# Altium schematic sheet 1_Measurement_and_MPPT.SchDoc: Measurement and MPPT
size A3; DrawnBy: Sara V. Martínez; Engineer: Flight; DocumentNumber: 4; Revision: V0.1; SheetNumber: 4; SheetTotal: 11
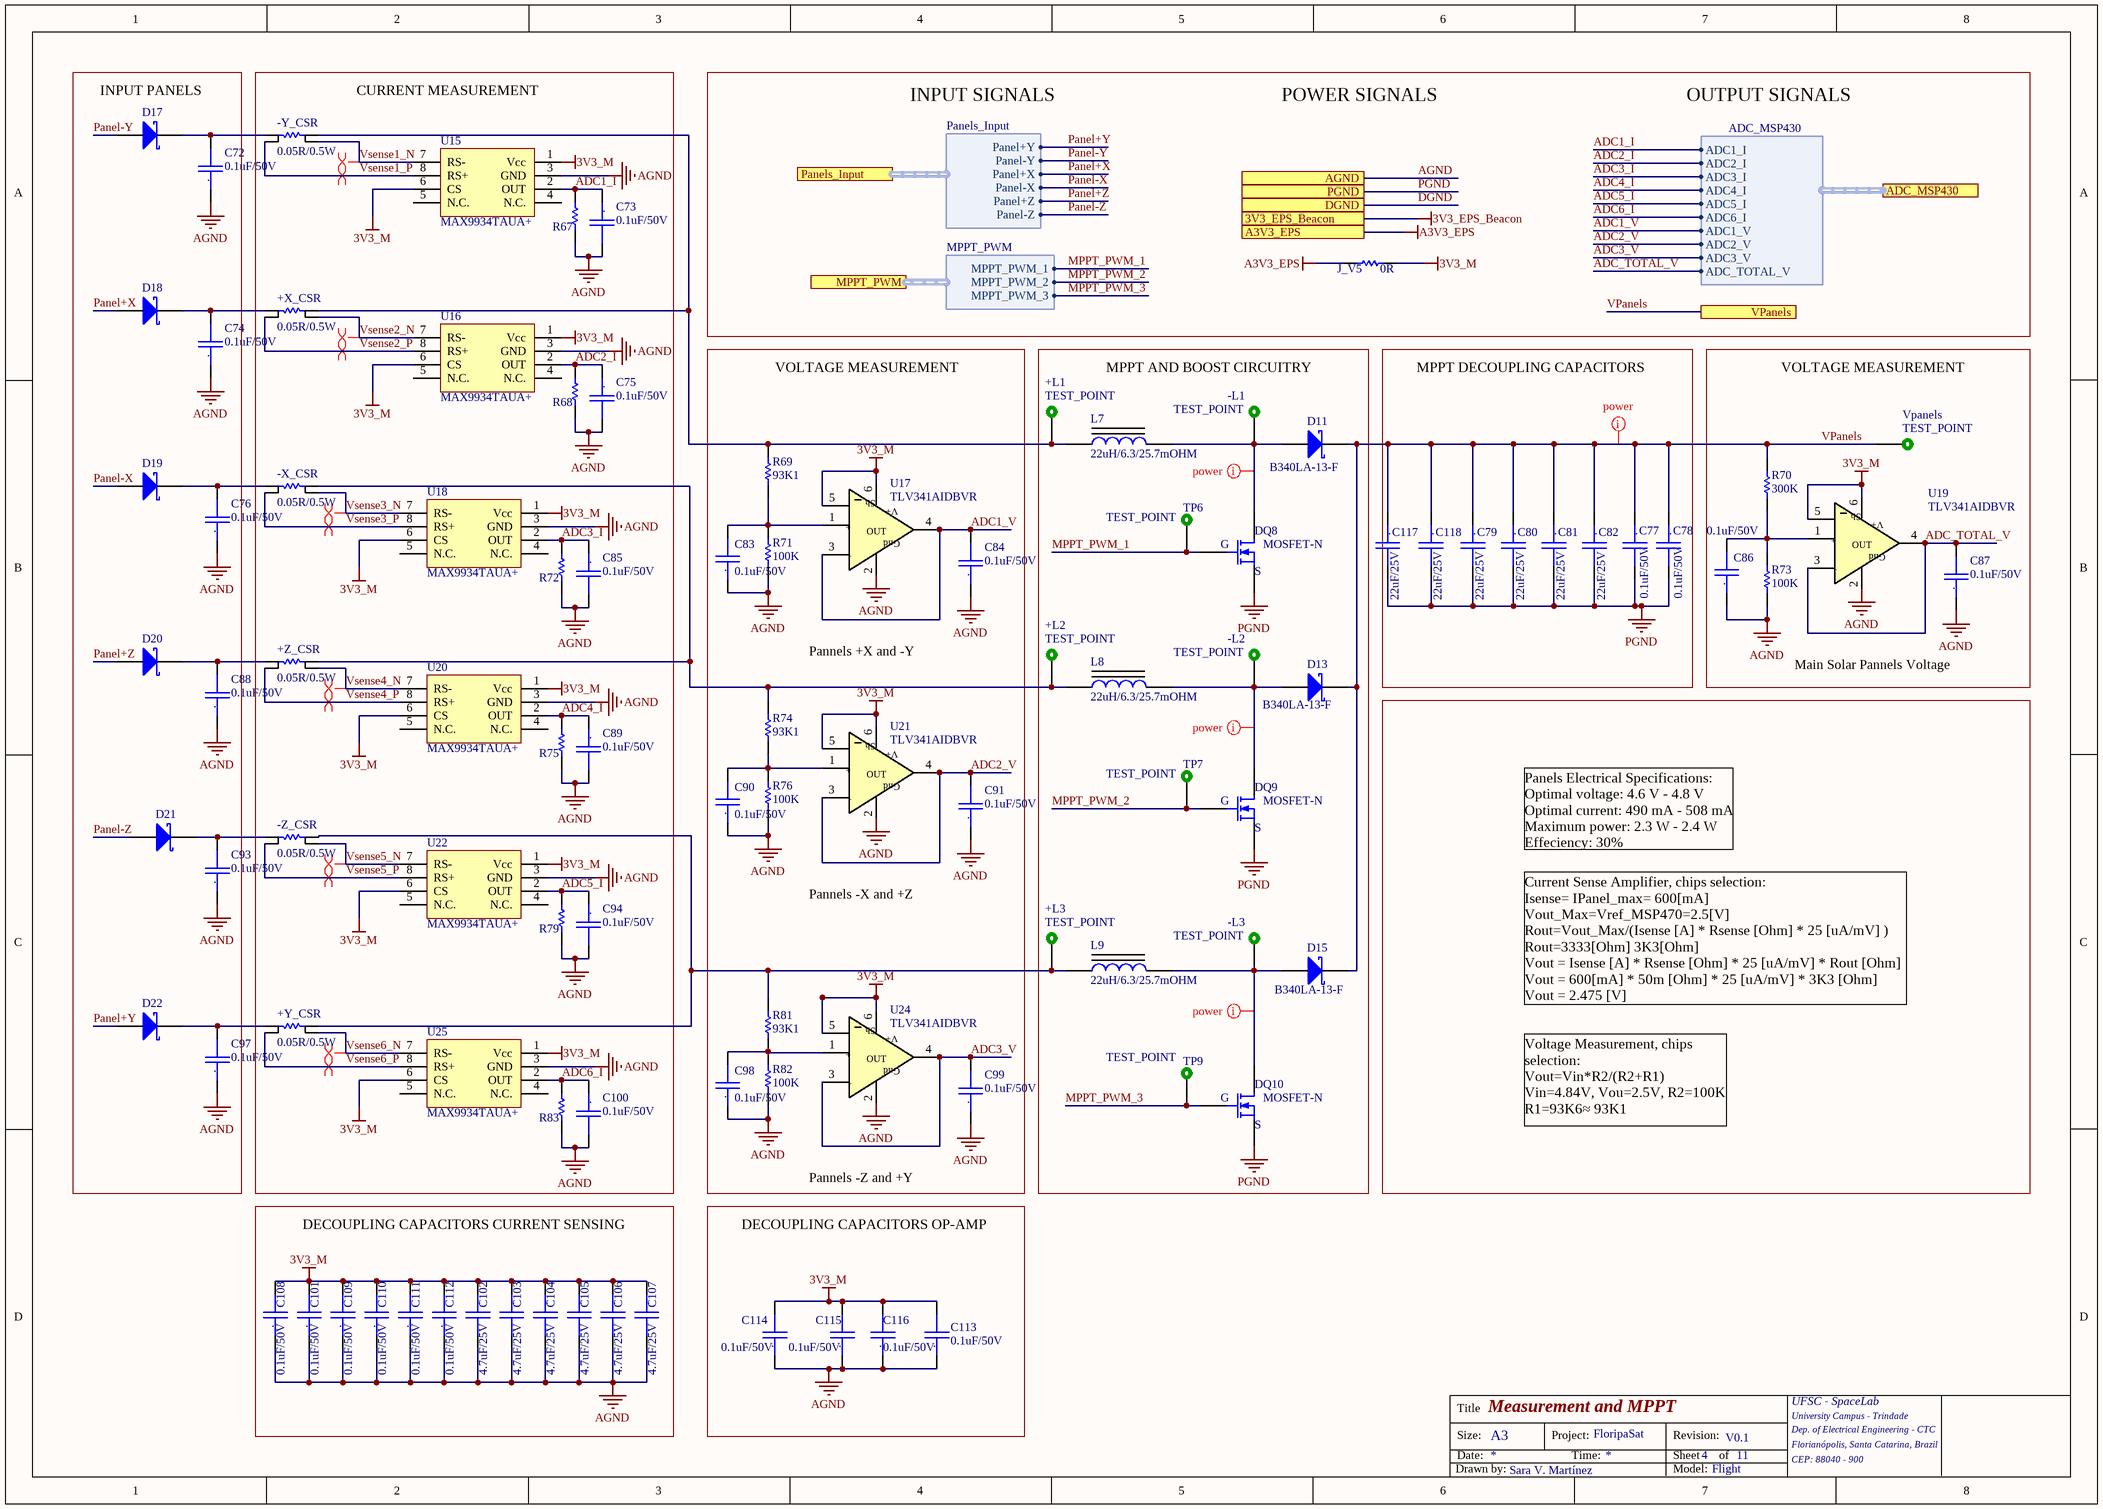
[diagram p0: 1_Measurement_and_MPPT.SchDoc]

## Parts
+L1  TEST_POINT  [TEST_POINT]  (no BOM)
+L2  TEST_POINT  [TEST_POINT]  (no BOM)
+L3  TEST_POINT  [TEST_POINT]  (no BOM)
+X_CSR  0.05R/0.5W  [1206 - ohmite]
+Y_CSR  0.05R/0.5W  [1206 - ohmite]
+Z_CSR  0.05R/0.5W  [1206 - ohmite]
-L1  TEST_POINT  [TEST_POINT]  (no BOM)
-L2  TEST_POINT  [TEST_POINT]  (no BOM)
-L3  TEST_POINT  [TEST_POINT]  (no BOM)
-X_CSR  0.05R/0.5W  [1206 - ohmite]
-Y_CSR  0.05R/0.5W  [1206 - ohmite]
-Z_CSR  0.05R/0.5W  [1206 - ohmite]
C72  0.1uF/50V  [CC0603]
C73  0.1uF/50V  [CC0603]
C74  0.1uF/50V  [CC0603]
C75  0.1uF/50V  [CC0603]
C76  0.1uF/50V  [CC0603]
C77  0.1uF/50V  [CC0805]
C78  0.1uF/50V  [CC0805]
C79  22uF/25V  [CC1210]
C80  22uF/25V  [CC1210]
C81  22uF/25V  [CC1210]
C82  22uF/25V  [CC1210]
C83  0.1uF/50V  [CC0603]
C84  0.1uF/50V  [CC0603]
C85  0.1uF/50V  [CC0603]
C86  0.1uF/50V  [CC0603]
C87  0.1uF/50V  [CC0603]
C88  0.1uF/50V  [CC0603]
C89  0.1uF/50V  [CC0603]
C90  0.1uF/50V  [CC0603]
C91  0.1uF/50V  [CC0603]
C93  0.1uF/50V  [CC0603]
C94  0.1uF/50V  [CC0603]
C97  0.1uF/50V  [CC0603]
C98  0.1uF/50V  [CC0603]
C99  0.1uF/50V  [CC0603]
C100  0.1uF/50V  [CC0603]
C101  0.1uF/50V  [CC0603]
C102  4.7uF/25V  [CC0805]
C103  4.7uF/25V  [CC0805]
C104  4.7uF/25V  [CC0805]
C105  4.7uF/25V  [CC0805]
C106  4.7uF/25V  [CC0805]
C107  4.7uF/25V  [CC0805]
C108  0.1uF/50V  [CC0603]
C109  0.1uF/50V  [CC0603]
C110  0.1uF/50V  [CC0603]
C111  0.1uF/50V  [CC0603]
C112  0.1uF/50V  [CC0603]
C113  0.1uF/50V  [CC0603]
C114  0.1uF/50V  [CC0603]
C115  0.1uF/50V  [CC0603]
C116  0.1uF/50V  [CC0603]
C117  22uF/25V  [CC1210]
C118  22uF/25V  [CC1210]
D11  B340LA-13-F  [DO-214AC]
D13  B340LA-13-F  [DO-214AC]
D15  B340LA-13-F  [DO-214AC]
D17  DNP  [SOD323F]  (value not drawn)
D18  DNP  [SOD323F]  (value not drawn)
D19  DNP  [SOD323F]  (value not drawn)
D20  DNP  [SOD323F]  (value not drawn)
D21  DNP  [SOD323F]  (value not drawn)
D22  DNP  [SOD323F]  (value not drawn)
J_V5  0R  [0805]
L7  22uH/6.3/25.7mOHM  [IND_HC9]
L8  22uH/6.3/25.7mOHM  [IND_HC9]
L9  22uH/6.3/25.7mOHM  [IND_HC9]
Q8  MOSFET-N  [SOIC8_Mosfet]
Q9  MOSFET-N  [SOIC8_Mosfet]
Q10  MOSFET-N  [SOIC8_Mosfet]
R67  3k3  [0805]  (value not drawn)
R68  3k3  [0805]  (value not drawn)
R69  93K1  [0603]
R70  300K  [0603]
R71  100K  [0603]
R72  3k3  [0805]  (value not drawn)
R73  100K  [0603]
R74  93K1  [0603]
R75  3k3  [0805]  (value not drawn)
R76  100K  [0603]
R79  3k3  [0805]  (value not drawn)
R81  93K1  [0603]
R82  100K  [0603]
R83  3k3  [0805]  (value not drawn)
TP6  TEST_POINT  [TEST_POINT]  (no BOM)
TP7  TEST_POINT  [TEST_POINT]  (no BOM)
TP9  TEST_POINT  [TEST_POINT]  (no BOM)
U15  MAX9934TAUA+  [MSOP-8]
U16  MAX9934TAUA+  [MSOP-8]
U17  TLV341AIDBVR  [SOT-23 6L]
U18  MAX9934TAUA+  [MSOP-8]
U19  TLV341AIDBVR  [SOT-23 6L]
U20  MAX9934TAUA+  [MSOP-8]
U21  TLV341AIDBVR  [SOT-23 6L]
U22  MAX9934TAUA+  [MSOP-8]
U24  TLV341AIDBVR  [SOT-23 6L]
U25  MAX9934TAUA+  [MSOP-8]
Vpanels  TEST_POINT  [TEST_POINT]  (no BOM)

## Blocks framed on the sheet
INPUT PANELS: C72 C74 C76 C88 C93 C97 D17-D22
CURRENT MEASUREMENT: +X_CSR +Y_CSR +Z_CSR -X_CSR -Y_CSR -Z_CSR C73 C75 C85 C89 C94 C100 R67 R68 R72 R75 R79 R83 U15 U16 U18 U20 U22 U25
VOLTAGE MEASUREMENT: C83 C84 C90 C91 C98 C99 R69 R71 R74 R76 R81 R82 U17 U21 U24
MPPT AND BOOST CIRCUITRY: +L1-+L3 -L1--L3 D11 D13 D15 L7-L9 Q8-Q10 TP6 TP7 TP9
MPPT DECOUPLING CAPACITORS: C77-C82 C117 C118
VOLTAGE MEASUREMENT: C86 C87 R70 R73 U19 Vpanels
DECOUPLING CAPACITORS CURRENT SENSING: C101-C112
DECOUPLING CAPACITORS OP-AMP: C113-C116

## Ports
3V3_EPS_Beacon, A3V3_EPS, ADC_MSP430 (harness ADC_MSP430), AGND, DGND, MPPT_PWM (harness MPPT_PWM), Panels_Input (harness Panels_Input), PGND, VPanels

## Harnesses
Panels_Input: Panel+Y, Panel-Y, Panel+X, Panel-X, Panel+Z, Panel-Z
ADC_MSP430: ADC1_I, ADC2_I, ADC3_I, ADC1_V, ADC2_V, ADC3_V, ADC_TOTAL_V, ADC4_I, ADC5_I, ADC6_I
MPPT_PWM: MPPT_PWM_1, MPPT_PWM_2, MPPT_PWM_3

## Nets
3V3_EPS_Beacon: port 3V3_EPS_Beacon
3V3_M: C101.2 C102.1 C103.1 C104.1 C105.1 C106.1 C107.1 C108.2 C109.2 C110.2 C111.2 C112.2 C113.2 C114.2 C115.2 C116.2 J_V5.1 U15.1(Vcc) U15.6(CS) U16.1(Vcc) U16.6(CS) U17.5(EN) U17.6(V+) U18.1(Vcc) U18.6(CS) U19.5(EN) U19.6(V+) U20.1(Vcc) U20.6(CS) U21.5(EN) U21.6(V+) U22.1(Vcc) U22.6(CS) U24.5(EN) U24.6(V+) U25.1(Vcc) U25.6(CS)
A3V3_EPS: J_V5.2 ; port A3V3_EPS
AGND: C72.1 C73.2 C74.1 C75.2 C76.1 C83.1 C84.1 C85.2 C86.1 C87.1 C88.1 C89.2 C90.1 C91.1 C93.1 C94.2 C97.1 C98.1 C99.1 C100.2 C101.1 C102.2 C103.2 C104.2 C105.2 C106.2 C107.2 C108.1 C109.1 C110.1 C111.1 C112.1 C113.1 C114.1 C115.1 C116.1 R67.1 R68.1 R71.1 R72.1 R73.1 R75.1 R76.1 R79.1 R82.1 R83.1 U15.3(GND) U16.3(GND) U17.2(Gnd) U18.3(GND) U19.2(Gnd) U20.3(GND) U21.2(Gnd) U22.3(GND) U24.2(Gnd) U25.3(GND) ; port AGND
PGND: C77.2 C78.2 C79.2 C80.2 C81.2 C82.2 C117.2 C118.2 Q8.1(S) Q9.1(S) Q10.1(S) ; port PGND
ADC1_I: C73.1 R67.2 U15.2(OUT) ; port ADC_MSP430.ADC1_I
ADC1_V: C84.2 U17.3(-IN) U17.4(OUT) ; port ADC_MSP430.ADC1_V
ADC2_I: C75.1 R68.2 U16.2(OUT) ; port ADC_MSP430.ADC2_I
ADC2_V: C91.2 U21.3(-IN) U21.4(OUT) ; port ADC_MSP430.ADC2_V
ADC3_I: C85.1 R72.2 U18.2(OUT) ; port ADC_MSP430.ADC3_I
ADC3_V: C99.2 U24.3(-IN) U24.4(OUT) ; port ADC_MSP430.ADC3_V
ADC4_I: C89.1 R75.2 U20.2(OUT) ; port ADC_MSP430.ADC4_I
ADC5_I: C94.1 R79.2 U22.2(OUT) ; port ADC_MSP430.ADC5_I
ADC6_I: C100.1 R83.2 U25.2(OUT) ; port ADC_MSP430.ADC6_I
ADC_TOTAL_V: C87.2 U19.3(-IN) U19.4(OUT) ; port ADC_MSP430.ADC_TOTAL_V
DGND: port DGND
MPPT_PWM_1: Q8.2(G) TP6.1 ; port MPPT_PWM.MPPT_PWM_1
MPPT_PWM_2: Q9.2(G) TP7.1 ; port MPPT_PWM.MPPT_PWM_2
MPPT_PWM_3: Q10.2(G) TP9.1 ; port MPPT_PWM.MPPT_PWM_3
Panel+X: D18.2(A) ; port Panels_Input.Panel+X
Panel+Y: D22.2(A) ; port Panels_Input.Panel+Y
Panel+Z: D20.2(A) ; port Panels_Input.Panel+Z
Panel-X: D19.2(A) ; port Panels_Input.Panel-X
Panel-Y: D17.2(A) ; port Panels_Input.Panel-Y
Panel-Z: D21.2(A) ; port Panels_Input.Panel-Z
VPanels: C77.1 C78.1 C79.1 C80.1 C81.1 C82.1 C117.1 C118.1 D11.1(K) D13.1(K) D15.1(K) R70.2 Vpanels.1 ; port VPanels
Vsense1_N: -Y_CSR.4 U15.7(RS-)
Vsense1_P: -Y_CSR.3 U15.8(RS+)
Vsense2_N: +X_CSR.4 U16.7(RS-)
Vsense2_P: +X_CSR.3 U16.8(RS+)
Vsense3_N: -X_CSR.4 U18.7(RS-)
Vsense3_P: -X_CSR.3 U18.8(RS+)
Vsense4_N: +Z_CSR.4 U20.7(RS-)
Vsense4_P: +Z_CSR.3 U20.8(RS+)
Vsense5_N: -Z_CSR.4 U22.7(RS-)
Vsense5_P: -Z_CSR.3 U22.8(RS+)
Vsense6_N: +Y_CSR.4 U25.7(RS-)
Vsense6_P: +Y_CSR.3 U25.8(RS+)
Net+L1_1: +L1.1 +X_CSR.2 -Y_CSR.2 L7.1 R69.2
Net+L2_1: +L2.1 +Z_CSR.2 -X_CSR.2 L8.1 R74.2
Net+L3_1: +L3.1 +Y_CSR.2 -Z_CSR.2 L9.1 R81.2
Net+X_CSR_1: +X_CSR.1 C74.2 D18.1(K)
Net+Y_CSR_1: +Y_CSR.1 C97.2 D22.1(K)
Net+Z_CSR_1: +Z_CSR.1 C88.2 D20.1(K)
Net-L1_1: -L1.1 D11.2(A) L7.2 Q8.3(D)
Net-L2_1: -L2.1 D13.2(A) L8.2 Q9.3(D)
Net-L3_1: -L3.1 D15.2(A) L9.2 Q10.3(D)
Net-X_CSR_1: -X_CSR.1 C76.2 D19.1(K)
Net-Y_CSR_1: -Y_CSR.1 C72.2 D17.1(K)
Net-Z_CSR_1: -Z_CSR.1 C93.2 D21.1(K)
NetC83_2: C83.2 R69.1 R71.2 U17.1(+IN)
NetC86_2: C86.2 R70.1 R73.2 U19.1(+IN)
NetC90_2: C90.2 R74.1 R76.2 U21.1(+IN)
NetC98_2: C98.2 R81.1 R82.2 U24.1(+IN)

Not connected (* = marked no-connect by the designer): U15 4(N.C.) 5(N.C.); U16 4(N.C.) 5(N.C.); U18 4(N.C.) 5(N.C.); U20 4(N.C.) 5(N.C.); U22 4(N.C.) 5(N.C.); U25 4(N.C.) 5(N.C.)

## Layout directives
differential pair: Vsense1_N, Vsense1_P, Vsense2_N, Vsense2_P, Vsense3_N, Vsense3_P, Vsense4_N, Vsense4_P, Vsense5_N, Vsense5_P, Vsense6_N, Vsense6_P
net class power: Net-L1_1, Net-L2_1, Net-L3_1, VPanels

## Notes on the sheet
- INPUT SIGNALS
- POWER SIGNALS
- OUTPUT SIGNALS
- Pannels +X and -Y
- Main Solar Pannels Voltage
- Panels Electrical Specifications:
  Optimal voltage: 4.6 V - 4.8 V
  Optimal current: 490 mA - 508 mA
  Maximum power: 2.3 W - 2.4 W
  Effeciency: 30%
- Pannels -X and +Z
- Current Sense Amplifier, chips selection:
  Isense= IPanel_max= 600[mA]
  Vout_Max=Vref_MSP470=2.5[V]
  Rout=Vout_Max/(Isense [A] * Rsense [Ohm] * 25 [uA/mV] )
  Rout=3333[Ohm] 3K3[Ohm]
  Vout = Isense [A] * Rsense [Ohm] * 25 [uA/mV] * Rout [Ohm]
  Vout = 600[mA] * 50m [Ohm] * 25 [uA/mV] * 3K3 [Ohm]
  Vout = 2.475 [V]
- Voltage Measurement, chips selection:
  Vout=Vin*R2/(R2+R1)
  Vin=4.84V, Vou=2.5V, R2=100K
  R1=93K6≈ 93K1
- Pannels -Z and +Y
- Title
- Size:
- Date:
- A3
- Project:
- Time:
- FloripaSat
- Revision:
- Sheet
- of
- UFSC - SpaceLab
- University Campus - Trindade
- Dep. of Electrical Engineering - CTC
- Florianópolis, Santa Catarina, Brazil
- CEP: 88040 - 900
- Drawn by:
- Model:
- (in symbol Cap_Cer_X7R_0.1uF_50V_0603) .
- (in symbol Cap_Cer_X7R_0.1uF_50V_0805) .
- (in symbol Cap_Cer_X7R_4.7uF_25V_0805) .
- (in symbol Cap_Cer_X7R_22uF_25V_1210) .
- (in symbol TLV341AIDBVR) Sh; +; -

## Library data of the parts
+L1-+L3 -L1--L3 TP6 TP7 TP9 Vpanels = TEST_POINT: Test point
+X_CSR +Y_CSR +Z_CSR -X_CSR -Y_CSR -Z_CSR = R0.05R_0.5%_0.5W_1206: Current Sense Resistors - SMD 0.05ohm .5% 4 Terminal; Partnumber: LVK12R050DER; Manufacturer: Ohmite; Max Power Dissipation: 500mW; Resistance: 50mR; Temperature Coefficient: 50ppm/°C; Tolerance: 0.5%; NCM: 8533.21.20; Case/Package: 1206; Case Code (Imperial): 1206; Case Code (Metric): 3216; ComponentLink1Description: http://www.ohmite.com/assets/docs/res_lvk.pdf?r=false&src-supplier=Digi-Key; ComponentLink1URL: http://www.ohmite.com/assets/docs/res_lvk.pdf?r=false&src-supplier=Digi-Key; ComponentLink2Description: http://www.farnell.com/datasheets/2553343.pdf?src-supplier=Element14; ComponentLink2URL: http://www.farnell.com/datasheets/2553343.pdf?src-supplier=Element14; ComponentLink3Description: http://www.ohmite.com/catalog/pdf/lvk.pdf?src-supplier=Element14; ComponentLink3URL: http://www.ohmite.com/catalog/pdf/lvk.pdf?src-supplier=Element14; ComponentLink4Description: https://www.alliedelec.com/m/d/8bcba2f42146915c5c22f667886779d2.pdf?src-supplier=Allied+Electronics; ComponentLink4URL: https://www.alliedelec.com/m/d/8bcba2f42146915c5c22f667886779d2.pdf?src-supplier=Allied+Electronics; Composition: Thick Film,Metal Film,Thin Film; Depth: 1.6mm; Features: Moisture Resistant; Height: 0.5mm; Length: 3.2mm; Manufacturer Part Number: LVK12R050DER; Max Operating Temperature: 125°C; Min Operating Temperature: -40°C; Mount: Surface Mount; Number of Terminations: 4; Package Quantity: 1; Packaging: Tape and Reel; Power Rating: 500mW; Pricing 1: 1=0.85, 10=0.784, 25=0.604, 100=0.531, 250=0.46, 500=0.385 (USD); Pricing 2: 1=0.89, 10=0.784, 25=0.7212, 50=0.6578, 100=0.5693, 250=0.48072, 500=0.4048, 1000=0.34408 (USD); REACH SVHC: Unknown; Stock 1: 13324; Stock 2: 3607; Supplier 1: Mouser; Supplier 2: Digi-Key; Supplier Part Number 1: 588-LVK12R050DER; Supplier Part Number 2: LVK12R050DERCT-ND; Termination: SMD/SMT; Width: 0.063inch
C72-C76 C83-C91 C93 C94 C97-C101 C108-C116 = Cap_Cer_X7R_0.1uF_50V_0603: CAP CER 0.1UF 50V 10% X7R 0603; Partnumber: CC0603KPX7R9BB104; Manufacturer: Yageo; Capacitance: 100nF; Case/Package: 0603; Case Code (Imperial): 0603; Case Code (Metric): 1608; ComponentLink1Description: https://www.verical.com/server-webapp/html/getDatasheet?partID=653026&src-supplier=Verical; ComponentLink1URL: https://www.verical.com/server-webapp/html/getDatasheet?partID=653026&src-supplier=Verical; Composition: Ceramic; Depth: 0.8mm; Dielectric: X7R; Halogen Free: Halogen Free; Height: 0.8mm; Lead Free: Lead Free; Length: 1.6mm; Manufacturer Part Number: CC0603KPX7R9BB104; Max Operating Temperature: 125°C; Min Operating Temperature: -55°C; Mount: Surface Mount; Number of Pins: 2; Packaging: Tape and Reel; Pricing 1: 1=0.1, 10=0.065, 100=0.02, 1000=0.016, 2500=0.013, 10000=0.01 (USD); Pricing 2: 1=0.1, 10=0.066, 50=0.036, 100=0.0293, 500=0.02094, 1000=0.01646, 2500=0.01496, 5000=0.01376 (USD); Radiation Hardening: No; Stock 1: 5712768; Stock 2: 0; Supplier 1: Mouser; Supplier 2: Digi-Key; Supplier Part Number 1: 603-CC603KPX7R9BB104; Supplier Part Number 2: 311-3567-1-ND; Termination: SMD/SMT; Thickness: 0.035inch; Tolerance: 10%; Voltage Rating (DC): 50V; Voltage Rating: 50V; Weight: 7.1E-05oz; Width: 0.031inch
C77 C78 = Cap_Cer_X7R_0.1uF_50V_0805: CAP CER 0.1UF 50V 10% X7R 0805; Partnumber: CC0805KRX7R9BB104; Manufacturer: Yageo; Material: Ceramic; Capacitance: 100nF; Insulation Resistance: 100GR; Supplier 1: Mouser; Supplier Part Number 1: 603-CC805KRX7R9BB104; Stock 1: 3904445; Pricing 1: 1=0.12, 10=0.087, 100=0.028, 1000=0.023, 4000=0.018, 8000=0.017 (USD); Mount: Surface Mount; Case/Package: 0805; Number of Pins: 2; Case Code (Metric): 2012; Case Code (Imperial): 0805; Min Operating Temperature: -55°C; Max Operating Temperature: 125°C; Tolerance: 10%; Dielectric: X7R; Packaging: Tape and Reel; Voltage Rating: 50V; Package Quantity: 1; Termination: SMD/SMT; Voltage: 50V; Length: 2mm; Height: 0.85mm; Depth: 1.25mm; Width: 0.049inch; Thickness: 0.033inch; Radiation Hardening: No; REACH SVHC: No SVHC; Lead Free: Lead Free; Halogen Free: Halogen Free; ComponentLink1URL: http://www.yageo.com/documents/recent/UPY-GPHC_X7R_6.3V-to-50V_8.pdf?src-supplier=Avnet; ComponentLink1Description: http://www.yageo.com/documents/recent/UPY-GPHC_X7R_6.3V-to-50V_8.pdf?src-supplier=Avnet; ComponentLink2URL: http://www.farnell.com/datasheets/1489800.pdf?src-supplier=Element14; ComponentLink2Description: http://www.farnell.com/datasheets/1489800.pdf?src-supplier=Element14; ComponentLink3URL: http://www.yageo.com/documents/recent/UPY-GPHC_X7R_6.3V-to-50V_18.pdf?src-supplier=Digi-Key; ComponentLink3Description: http://www.yageo.com/documents/recent/UPY-GPHC_X7R_6.3V-to-50V_18.pdf?src-supplier=Digi-Key; ComponentLink4URL: http://www.farnell.com/datasheets/2167236.pdf?src-supplier=Element14; ComponentLink4Description: http://www.farnell.com/datasheets/2167236.pdf?src-supplier=Element14; ComponentLink5URL: http://www.yageo.com/documents/recent/UPY-GPHC_X7R_6.3V-to-50V_8.pdf?src-supplier=Avnet+Europe; ComponentLink5Description: http://www.yageo.com/documents/recent/UPY-GPHC_X7R_6.3V-to-50V_8.pdf?src-supplier=Avnet+Europe; ComponentLink6URL: http://www.produktinfo.conrad.com/datenblaetter/425000-449999/445210-da-01-en-KERKO_CHIP_0805_X7R_0_1uF_10Proz_50VG.pdf?src-supplier=Conrad; ComponentLink6Description: http://www.produktinfo.conrad.com/datenblaetter/425000-449999/445210-da-01-en-KERKO_CHIP_0805_X7R_0_1uF_10Proz_50VG.pdf?src-supplier=Conrad; Supplier 2: Digi-Key; Supplier Part Number 2: 311-1140-1-ND; Stock 2: 544494; Pricing 2: 1=0.12, 10=0.088, 50=0.05, 100=0.0414, 500=0.02906, 1000=0.02405 (USD); Manufacturer Part Number: CC0805KRX7R9BB104
C79-C82 C117 C118 = Cap_Cer_X7R_22uF_25V_1210: CAP CER 22uF 25V 10% X7R 1210; Partnumber: GRM32ER71E226KE15L; Manufacturer: Murata; Material: Ceramic; Capacitance: 22uF; Case/Package: 1210; Case Code (Imperial): 1210; Case Code (Metric): 3225; ComponentLink1Description: http://www.farnell.com/datasheets/2048964.pdf?src-supplier=Farnell; ComponentLink1URL: http://www.farnell.com/datasheets/2048964.pdf?src-supplier=Farnell; ComponentLink2Description: http://psearch.murata.com/capacitor/product/GRM32ER71E226KE15%23.pdf?src-supplier=Future+Electronics; ComponentLink2URL: http://psearch.murata.com/capacitor/product/GRM32ER71E226KE15%23.pdf?src-supplier=Future+Electronics; ComponentLink3Description: https://www.murata.com/~/media/webrenewal/support/library/catalog/products/capacitor/mlcc/c02e.ashx?la=en-us&src-supplier=Digi-Key; ComponentLink3URL: https://www.murata.com/~/media/webrenewal/support/library/catalog/products/capacitor/mlcc/c02e.ashx?la=en-us&src-supplier=Digi-Key; ComponentLink4Description: http://components.arrow.com/part/dataview/47905228S8888111N2606?src-supplier=Arrow; ComponentLink4URL: http://components.arrow.com/part/dataview/47905228S8888111N2606?src-supplier=Arrow; ComponentLink5Description: http://www.farnell.com/datasheets/2048964.pdf?src-supplier=Element14; ComponentLink5URL: http://www.farnell.com/datasheets/2048964.pdf?src-supplier=Element14; ComponentLink6Description: http://uk.rs-online.com/webdocs/13d2/0900766b813d2caa.pdf?src-supplier=RSComponents; ComponentLink6URL: http://uk.rs-online.com/webdocs/13d2/0900766b813d2caa.pdf?src-supplier=RSComponents; ComponentLink7Description: https://produktinfo.conrad.com/datenblaetter/450000-474999/451826-da-01-de-VS_KONDENS_GRM32_ER71E_226KE15L.pdf?src-supplier=Conrad; ComponentLink7URL: https://produktinfo.conrad.com/datenblaetter/450000-474999/451826-da-01-de-VS_KONDENS_GRM32_ER71E_226KE15L.pdf?src-supplier=Conrad; Depth: 2.5mm; Dielectric: X7R; Height: 2.5mm; Lead Free: Lead Free; Length: 3.2mm; Manufacturer Part Number: GRM32ER71E226KE15L; Max Operating Temperature: 125°C; Min Operating Temperature: -55°C; Mount: Surface Mount; Number of Pins: 2; Package Quantity: 1; Packaging: Tape and Reel; Pricing 1: 1=1.96, 10=1.54, 25=1.54, 100=1.15, 250=1.15, 500=0.876 (USD); Pricing 2: 1=1.87, 10=1.479, 50=1.2816, 100=1.1091, 500=0.83802 (USD); Radiation Hardening: No; REACH SVHC: No SVHC; Stock 1: 169862; Stock 2: 0; Supplier 1: Mouser; Supplier 2: Digi-Key; Supplier Part Number 1: 81-GRM32ER71E226KE5L; Supplier Part Number 2: 490-5313-1-ND; Termination: SMD/SMT; Thickness: 0.106inch; Tolerance: 10%; Voltage: 25V; Voltage Rating (DC): 25V; Voltage Rating: 25V; Width: 0.098inch
C102-C107 = Cap_Cer_X7R_4.7uF_25V_0805: CAP CER 4.7uF 25V 10% X7R 0805; Partnumber: CC0805KKX7R8BB475; Manufacturer: Yageo; NCM: 8532.24.10; Capacitance: 4.7uF; Case/Package: 0805; Case Code (Imperial): 0805; Case Code (Metric): 2012; ComponentLink1Description: http://www.mouser.com/ds/2/447/Yageo_UPY-GP_NP0_16V-to-50V_9-358835.pdf?src-supplier=Mouser; ComponentLink1URL: http://www.mouser.com/ds/2/447/Yageo_UPY-GP_NP0_16V-to-50V_9-358835.pdf?src-supplier=Mouser; ComponentLink2Description: http://www.yageo.com/documents/recent/UPY-GPHC_X7R_6.3V-to-50V_18.pdf?src-supplier=Digi-Key; ComponentLink2URL: http://www.yageo.com/documents/recent/UPY-GPHC_X7R_6.3V-to-50V_18.pdf?src-supplier=Digi-Key; Dielectric: X7R; Halogen Free: Halogen Free; Lead Free: Lead Free; Length: 0.079inch; Manufacturer Part Number: CC0805KKX7R8BB475; Max Operating Temperature: 125°C; Min Operating Temperature: -55°C; Mount: Surface Mount; Package Quantity: 3000; Packaging: Tape and Reel; Pricing 1: 1=0.43, 10=0.25, 100=0.139, 1000=0.126, 3000=0.089, 9000=0.086 (USD); Pricing 2: 1=0.47, 10=0.327, 50=0.2288, 100=0.1962, 500=0.14714, 1000=0.12425 (USD); Stock 1: 121; Stock 2: 672; Supplier 1: Mouser; Supplier 2: Digi-Key; Supplier Part Number 1: 603-CC805KKX7R8BB475; Supplier Part Number 2: 311-1885-1-ND; Termination: SMD/SMT; Thickness: 0.057inch; Tolerance: 10%; Voltage Rating (DC): 25V; Voltage Rating: 25V; Weight: 0.000194oz; Width: 0.049inch
D11 D13 D15 = DIODE_SCHOTTKY_40V_3A_B340LA-13-F: DIODE SCHOTTKY 40V 3A B340LA-13-F; Manufacturer: Diodes; Capacitance: 180pF; Element Configuration: Single; Forward Voltage: 450mV; Max Forward Surge Current (Ifsm): 70A; Peak Reverse Current: 2mA; Polarity: Standard; NCM: 8541.10.29; Partnumber: B340LA-13-F; Average Rectified Current: 3A; Case/Package: SMA; ComponentLink1Description: http://www.farnell.com/datasheets/2238478.pdf?src-supplier=Element14; ComponentLink1URL: http://www.farnell.com/datasheets/2238478.pdf?src-supplier=Element14; ComponentLink2Description: http://www.diodes.com/datasheets/ds30240.pdf?src-supplier=Future+Electronics; ComponentLink2URL: http://www.diodes.com/datasheets/ds30240.pdf?src-supplier=Future+Electronics; ComponentLink3Description: http://www.jameco.com/Jameco/Products/ProdDS/1538881.pdf?src-supplier=Jameco; ComponentLink3URL: http://www.jameco.com/Jameco/Products/ProdDS/1538881.pdf?src-supplier=Jameco; ComponentLink4Description: https://www.diodes.com/assets/Datasheets/ds30240.pdf?src-supplier=Digi-Key; ComponentLink4URL: https://www.diodes.com/assets/Datasheets/ds30240.pdf?src-supplier=Digi-Key; ComponentLink5Description: https://www.verical.com/server-webapp/html/getDatasheet?partID=256588&src-supplier=Verical; ComponentLink5URL: https://www.verical.com/server-webapp/html/getDatasheet?partID=256588&src-supplier=Verical; Current Rating: 3A; Forward Current: 3A; Height: 2.1mm; Lead Free: Lead Free; Length: 4.6mm; Manufacturer Part Number: B340LA-13-F; Max Operating Temperature: 125°C; Max Repetitive Reverse Voltage (Vrrm): 40V; Max Reverse Voltage (DC): 40V; Min Operating Temperature: -55°C; Mount: Surface Mount; Number of Pins: 2; Output Current: 3A; Package Quantity: 5000; Packaging: Tape and Reel; Peak Non-Repetitive Surge Current: 70A; Pricing 1: 1=0.51, 10=0.417, 100=0.255, 1000=0.197, 5000=0.168, 10000=0.168 (USD); Pricing 2: 1=0.4, 10=0.341, 25=0.318, 100=0.2363, 250=0.22452, 500=0.18452, 1000=0.14999, 2500=0.1409 (USD); Radiation Hardening: No; REACH SVHC: No SVHC; Stock 1: 21204; Stock 2: 96615; Supplier 1: Mouser; Supplier 2: Digi-Key; Supplier Part Number 1: 621-B340LA-F; Supplier Part Number 2: B340LA-FDICT-ND; Termination: SMD/SMT; Voltage Rating (DC): 40V; Weight: 0.002258oz; Width: 2.92mm
D17-D22 = DIODE_SCHOTTKY_23V_1A_NSVR0320MW2T1G: DIODE SCHOTTKY 23V 1A SOD323F; Manufacturer: ON Semiconductor; Element Configuration: Single; Forward Voltage: 500mV; Max Forward Surge Current (Ifsm): 5A; Max Repetitive Reverse Voltage (Vrrm): 20V; Max Reverse Leakage Current: 1mA; Peak Reverse Current: 50uA; NCM: 8541.10.29; Partnumber: NSVR0320MW2T1G; Average Rectified Current: 1A; Case/Package: SOD-323-2; ComponentLink1Description: http://www.onsemi.com/pub/Collateral/NSR0320MW2T1-D.PDF?src-supplier=Avnet; ComponentLink1URL: http://www.onsemi.com/pub/Collateral/NSR0320MW2T1-D.PDF?src-supplier=Avnet; ComponentLink2Description: http://www.onsemi.com/pub/Collateral/NSR0320MW2T1-D.PDF?src-supplier=Digi-Key; ComponentLink2URL: http://www.onsemi.com/pub/Collateral/NSR0320MW2T1-D.PDF?src-supplier=Digi-Key; Forward Current: 1A; Height: 0.9mm; Lead Free: Lead Free; Length: 1.8mm; Manufacturer Part Number: NSVR0320MW2T1G; Max Operating Temperature: 125°C; Max Reverse Voltage (DC): 20V; Max Surge Current: 5A; Min Operating Temperature: -55°C; Number of Pins: 2; Package Quantity: 3000; Packaging: Tape and Reel; Pricing 1: 1=0.38, 10=0.254, 100=0.118, 1000=0.092, 3000=0.081, 9000=0.071 (USD); Pricing 2: 1=0.38, 10=0.282, 25=0.2548, 100=0.1343, 250=0.13288, 500=0.119, 1000=0.0926 (USD); Radiation Hardening: No; REACH SVHC: No SVHC; Stock 1: 10408; Stock 2: 4746; Supplier 1: Mouser; Supplier 2: Digi-Key; Supplier Part Number 1: 863-NSVR0320MW2T1G; Supplier Part Number 2: NSVR0320MW2T1GOSCT-ND; Width: 1.35mm
J_V5 = R0R_JUMPER_1/8W_0805: RES 0R OHM 1/8W JUMPER 0805; Partnumber: CRCW08050000Z0EA; Manufacturer: Vishay; Max Power Dissipation: 125mW; Resistance: 0mR; Temperature Coefficient: 100ppm/°C; Tolerance: 1%; Voltage Rating (DC): 150V; Fitted: No (jumper resistor); Case/Package: 0805; Case Code (Imperial): 0805; Case Code (Metric): 2012; ComponentLink1Description: http://www.vishay.com/docs/20035/dcrcwe3.pdf?src-supplier=Avnet+Europe; ComponentLink1URL: http://www.vishay.com/docs/20035/dcrcwe3.pdf?src-supplier=Avnet+Europe; ComponentLink2Description: http://www.vishay.com/docs/20035/dcrcwe3.pdf?src-supplier=Distrelec; ComponentLink2URL: http://www.vishay.com/docs/20035/dcrcwe3.pdf?src-supplier=Distrelec; ComponentLink3Description: http://www.vishay.com/docs/20035/dcrcwe3.pdf?src-supplier=Mouser; ComponentLink3URL: http://www.vishay.com/docs/20035/dcrcwe3.pdf?src-supplier=Mouser; ComponentLink4Description: http://uk.rs-online.com/webdocs/0d98/0900766b80d98b26.pdf?src-supplier=RSComponents; ComponentLink4URL: http://uk.rs-online.com/webdocs/0d98/0900766b80d98b26.pdf?src-supplier=RSComponents; ComponentLink5Description: http://www.vishay.com/docs/20035/dcrcwe3.pdf?src-supplier=Future+Electronics; ComponentLink5URL: http://www.vishay.com/docs/20035/dcrcwe3.pdf?src-supplier=Future+Electronics; ComponentLink6Description: http://www.vishay.com/docs/20035/dcrcwe3.pdf?src-supplier=Allied+Electronics; ComponentLink6URL: http://www.vishay.com/docs/20035/dcrcwe3.pdf?src-supplier=Allied+Electronics; ComponentLink7Description: http://www.vishay.com/docs/20035/dcrcwe3.pdf?src-supplier=Digi-Key; ComponentLink7URL: http://www.vishay.com/docs/20035/dcrcwe3.pdf?src-supplier=Digi-Key; ComponentLink8Description: http://www.farnell.com/datasheets/2310790.pdf?src-supplier=Element14; ComponentLink8URL: http://www.farnell.com/datasheets/2310790.pdf?src-supplier=Element14; Composition: Thick Film; Contact Plating: Tin,Lead; Depth: 1.25mm; Features: Automotive AEC-Q200; Height: 0.45mm; Lead Free: Lead Free; Length: 2mm; Manufacturer Part Number: CRCW08050000Z0EA; Max Operating Temperature: 155°C; Military Standard: Not; Min Operating Temperature: -55°C; Number of Terminations: 2; Package Quantity: 1; Packaging: Tape and Reel; Power Rating: 125mW; Pricing 1: 1=0.1, 10=0.024, 100=0.01, 1000=0.007, 5000=0.004, 10000=0.004 (USD); Pricing 2: 1=0.1, 10=0.04, 25=0.0288, 50=0.022, 100=0.0162, 250=0.01236, 500=0.0099, 1000=0.00729 (USD); Radiation Hardening: No; REACH SVHC: Unknown; Stock 1: 903478; Stock 2: 399530; Supplier 1: Mouser; Supplier 2: Digi-Key; Supplier Part Number 1: 71-CRCW0805-0-E3; Supplier Part Number 2: 541-0.0ADKR-ND; Termination: SMD/SMT; Voltage Rating: 150V; Weight: 0.000194oz; Width: 1.25mm
L7-L9 = IND_POWER_22uH_6.3A_25.7mR: HC9 Series - 22uH / 6.3A / 25.7mOHM; Partnumber: HC9-220-R; Manufacturer: Eaton Cooper; Core Material: Ferrite; DC Resistance (DCR): 25.7mR; Inductance Tolerance: 15%; Saturation Current: 8.7A; Shielding: Unshielded; Test Frequency: 100kHz; NCM: 8504.50.00; Case/Package: SMD/SMT; ComponentLink1Description: http://www.mouser.com/ds/2/87/Bus_Elx_DS_4312_HC9_Series-475744.pdf?src-supplier=Mouser; ComponentLink1URL: http://www.mouser.com/ds/2/87/Bus_Elx_DS_4312_HC9_Series-475744.pdf?src-supplier=Mouser; ComponentLink2Description: http://www.farnell.com/datasheets/175565.pdf?src-supplier=Element14; ComponentLink2URL: http://www.farnell.com/datasheets/175565.pdf?src-supplier=Element14; ComponentLink3Description: http://www.cooperindustries.com/content/dam/public/bussmann/Electronics/Resources/product-datasheets/Bus_Elx_DS_4312_HC9_Series.pdf?src-supplier=Future+Electronics; ComponentLink3URL: http://www.cooperindustries.com/content/dam/public/bussmann/Electronics/Resources/product-datasheets/Bus_Elx_DS_4312_HC9_Series.pdf?src-supplier=Future+Electronics; ComponentLink4Description: http://www.cooperindustries.com/content/dam/public/bussmann/Electronics/Resources/product-datasheets/Bus_Elx_DS_4312_HC9_Series.pdf?src-supplier=Onlinecomponents.com; ComponentLink4URL: http://www.cooperindustries.com/content/dam/public/bussmann/Electronics/Resources/product-datasheets/Bus_Elx_DS_4312_HC9_Series.pdf?src-supplier=Onlinecomponents.com; Current Rating: 6.3A; Depth: 13.1mm; Height: 7.5mm; Inductance: 22uH; Lead Free: Lead Free; Length: 13.8mm; Manufacturer Part Number: HC9-220-R; Max DC Current: 6.3A; Max Operating Temperature: 155°C; Military Standard: Not; Min Operating Temperature: -40°C; Mount: Surface Mount; Number of Pins: 2; Package Quantity: 450; Packaging: Tape and Reel; Pricing 1: 1=3.48, 10=3, 100=2.41, 450=1.71, 900=1.47, 2250=1.43 (USD); Pricing 2: 1=2.74, 10=2.529, 25=2.3184, 50=1.9812, 100=1.7704 (USD); Radiation Hardening: No; REACH SVHC: No SVHC; RMS Current (Irms): 6.3A; Stock 1: 1694; Stock 2: 9707; Supplier 1: Mouser; Supplier 2: Digi-Key; Supplier Part Number 1: 704-HC9-220-R; Supplier Part Number 2: 513-1349-1-ND; Termination: SMD/SMT; Tolerance: 15%; Weight: 0.256oz; Width: 13.1mm
Q8-Q10 = MOSFET-N_30V_SI4166DY: MOSFET N-Channel 30V Vds 20V Vgs SO-8; Partnumber: SI4166DY-T1-GE3; Manufacturer: Vishay Siliconix; Continuous Drain Current (ID): 20.5A; Drain to Source Resistance: 4.5mR; Fall Time: 15ns; Input Capacitance: 2.73nF; Max Power Dissipation: 6.5W; Number of Channels: 1; On-State Resistance: 3.9MR; Power Dissipation: 3W; Rise Time: 19ns; Threshold Voltage: 1.2V; Turn-Off Delay Time: 35ns; Turn-On Delay Time: 30ns; Published: 8-Jun-2000; LatestRevisionDate: 17-Jul-2002; LatestRevisionNote: Re-released for DXP Platform.; PackageVersion: 1995/1996; PackageReference: E3; Publisher: Altium Limited; PackageDescription: TO, Flat Index; 3 In-Line, Axial Leads; Body Dia. 4.6mm; Lead Dia. 0.5 mm (max); Case/Package: SOIC; ComponentLink1Description: http://www.vishay.com/docs/68953/si4166dy.pdf?src-supplier=Digi-Key; ComponentLink1URL: http://www.vishay.com/docs/68953/si4166dy.pdf?src-supplier=Digi-Key; ComponentLink2Description: http://www.vishay.com/docs/68953/si4166dy.pdf?src-supplier=Future+Electronics; ComponentLink2URL: http://www.vishay.com/docs/68953/si4166dy.pdf?src-supplier=Future+Electronics; ComponentLink3Description: http://www.mouser.com/ds/2/427/si4166dy-244566.pdf?src-supplier=Mouser; ComponentLink3URL: http://www.mouser.com/ds/2/427/si4166dy-244566.pdf?src-supplier=Mouser; Contact Plating: Tin,Matte; Drain to Source Breakdown Voltage: 30V; Drain to Source Voltage (Vdss): 30V; Gate to Source Voltage (Vgs): 20V; Height: 1.55mm; Lead Free: Lead Free; Length: 5mm; Manufacturer Part Number: SI4166DY-T1-GE3; Max Operating Temperature: 150°C; Min Operating Temperature: -55°C; Mount: Surface Mount; Number of Elements: 1; Number of Pins: 8; Package Quantity: 1; Packaging: Tape and Reel; Pricing 1: 1=1.43, 10=1.21, 100=0.952, 500=0.799, 1000=0.648, 2500=0.648 (USD); Pricing 2: 1=1.39, 10=1.239, 25=1.176, 100=0.882, 250=0.8736, 500=0.7476, 1000=0.609 (USD); Radiation Hardening: No; Rds On Max: 3.9mR; REACH SVHC: Unknown; Stock 1: 3322; Stock 2: 1522; Supplier 1: Mouser; Supplier 2: Digi-Key; Supplier Part Number 1: 781-SI4166DY-T1-GE3; Supplier Part Number 2: SI4166DY-T1-GE3CT-ND; Weight: 0.006596oz; Width: 4mm
R67 R68 R72 R75 R79 R83 = R3.3k_0.1%_1/10W_0805: RES SMD 3.3K OHM 0.1% 1/10W 0805; Manufacturer: TE Connectivity Neohm; Manufacturer Part Number: CPF0805B3K3E1; Resistance: 3.3kR; Temperature Coefficient: 25ppm/°C; Voltage Rating: 100V; Power Rating: 100mW; Voltage Rating (DC): 200V; Number of Resistors: 1; Supplier 1: Mouser; Supplier Part Number 1: 279-CPF0805B3K3E1; Stock 1: 1306; Pricing 1: 1=0.67, 10=0.485, 100=0.252, 1000=0.135, 2000=0.117, 10000=0.114 (USD); Mount: Surface Mount; Case/Package: 0805; Weight: 0.000194oz; Case Code (Metric): 2012; Case Code (Imperial): 0805; Min Operating Temperature: -55°C; Max Operating Temperature: 155°C; Tolerance: 0.1%; Packaging: Tape and Reel; Composition: Thin Film; Package Quantity: 1000; Number of Terminations: 2; Termination: Solder; Length: 2mm; Height: 0.55mm; Width: 1.25mm; REACH SVHC: No SVHC; ELV: Compliant; ComponentLink1URL: http://www.farnell.com/datasheets/1786775.pdf?src-supplier=Element14; ComponentLink1Description: http://www.farnell.com/datasheets/1786775.pdf?src-supplier=Element14; Supplier 2: Digi-Key; Supplier Part Number 2: A102339CT-ND; Stock 2: 1176; Pricing 2: 1=0.65, 10=0.463, 100=0.2408 (USD)
R69 R74 R81 = R93.1K_1%_1/10W_0603: RES 93.1K OHM 1/10W 1% 0603; Partnumber: CRCW060393K1FKEA; Manufacturer: Vishay; Max Power Dissipation: 100mW; Resistance: 93.1kR; Temperature Coefficient: 100ppm/°C; Voltage Rating (DC): 75V; NCM: 8533.21.20; Case/Package: 0603; Case Code (Imperial): 0603; Case Code (Metric): 1608; ComponentLink1Description: http://www.farnell.com/datasheets/2046716.pdf?src-supplier=Element14; ComponentLink1URL: http://www.farnell.com/datasheets/2046716.pdf?src-supplier=Element14; ComponentLink2Description: http://www.farnell.com/datasheets/2111203.pdf?src-supplier=Element14; ComponentLink2URL: http://www.farnell.com/datasheets/2111203.pdf?src-supplier=Element14; ComponentLink3Description: https://www.alliedelec.com/m/d/0c934d6939ccefa68dbe0b96d821c8cf.pdf?src-supplier=Allied+Electronics; ComponentLink3URL: https://www.alliedelec.com/m/d/0c934d6939ccefa68dbe0b96d821c8cf.pdf?src-supplier=Allied+Electronics; ComponentLink4Description: http://www.vishay.com/docs/20035/dcrcwe3.pdf?src-supplier=Digi-Key; ComponentLink4URL: http://www.vishay.com/docs/20035/dcrcwe3.pdf?src-supplier=Digi-Key; ComponentLink5Description: http://www.farnell.com/datasheets/1697337.pdf?src-supplier=Element14; ComponentLink5URL: http://www.farnell.com/datasheets/1697337.pdf?src-supplier=Element14; ComponentLink6Description: http://www.mouser.com/ds/2/427/dcrcwe3-109170.pdf?src-supplier=Mouser; ComponentLink6URL: http://www.mouser.com/ds/2/427/dcrcwe3-109170.pdf?src-supplier=Mouser; ComponentLink7Description: http://www.vishay.com/docs/20035/dcrcwe3.pdf?src-supplier=Avnet; ComponentLink7URL: http://www.vishay.com/docs/20035/dcrcwe3.pdf?src-supplier=Avnet; ComponentLink8Description: http://www.vishay.com/docs/20035/dcrcwe3.pdf?src-supplier=Future+Electronics; ComponentLink8URL: http://www.vishay.com/docs/20035/dcrcwe3.pdf?src-supplier=Future+Electronics; Composition: Thick Film; Contact Plating: Tin; Depth: 0.85mm; Features: Automotive AEC-Q200; Height: 0.45mm; Lead Free: Lead Free; Length: 1.55mm; Manufacturer Part Number: CRCW060393K1FKEA; Max Operating Temperature: 155°C; Military Standard: Not; Min Operating Temperature: -55°C; Mount: Surface Mount; Number of Pins: 2; Number of Terminations: 2; Package Quantity: 10; Packaging: Tape and Reel; Power Rating: 100mW; Pricing 1: 1=0.1, 10=0.037, 100=0.034, 500=0.015, 1000=0.006, 2500=0.005 (USD); Pricing 2: 1=0.1, 10=0.034, 100=0.0139, 1000=0.00623, 2500=0.0054 (USD); Radiation Hardening: No; REACH SVHC: Unknown; Stock 1: 10084; Stock 2: 12334; Supplier 1: Mouser; Supplier 2: Digi-Key; Supplier Part Number 1: 71-CRCW0603-93.1K-E3; Supplier Part Number 2: 541-93.1KHCT-ND; Termination: SMD/SMT; Tolerance: 1%; Voltage Rating: 75V; Weight: 7.1E-05oz; Width: 0.033inch; Working Voltage: 75V
R70 = R300K_0.1%_1/10W_0603: RES 300K OHM 1/10W 0.1% 0603; Partnumber: RG1608P-304-B-T5; Manufacturer: Susumu; Max Power Dissipation: 100mW; Power Rating: 62.5mW; Resistance: 300kR; Temperature Coefficient: 25ppm/°C; Voltage Rating (DC): 75V; NCM: 8533.21.20; Case/Package: 0603; Case Code (Imperial): 0603; Case Code (Metric): 1608; ComponentLink1Description: http://susumu-usa.com/pdf/RG_RM_RGH_DATASHEET.pdf?src-supplier=Future+Electronics; ComponentLink1URL: http://susumu-usa.com/pdf/RG_RM_RGH_DATASHEET.pdf?src-supplier=Future+Electronics; ComponentLink2Description: http://www.mouser.com/ds/2/392/n_catalog_partition01_en-1140338.pdf?src-supplier=Mouser; ComponentLink2URL: http://www.mouser.com/ds/2/392/n_catalog_partition01_en-1140338.pdf?src-supplier=Mouser; Composition: Thin Film; Height: 0.02inch; Lead Free: Lead Free; Length: 0.063inch; Manufacturer Part Number: RG1608P-304-B-T5; Max Operating Temperature: 155°C; Min Operating Temperature: -55°C; Number of Terminations: 2; Package Quantity: 1; Packaging: Tape and Reel; Pricing 1: 1=0.4, 10=0.303, 100=0.127, 500=0.102, 1000=0.07, 2500=0.065 (USD); Pricing 2: 1=0.4, 10=0.303, 100=0.1273, 1000=0.07022, 2500=0.06584 (USD); Stock 1: 6874; Stock 2: 54195; Supplier 1: Mouser; Supplier 2: Digi-Key; Supplier Part Number 1: 754-RG1608P-304-B-T5; Supplier Part Number 2: RG16P300KBCT-ND; Termination: SMD/SMT; Tolerance: 0.1%; Voltage Rating: 75V; Width: 0.031inch
R71 R73 R76 R82 = R100K_1%_1/10W_0603: RES 100K OHM 1/10W 1% 0603; Partnumber: CRCW0603100KFKEA; Manufacturer: Vishay; Manufacturer Part Number: CRCW0603-100KFKEA; Max Power Dissipation: 100mW; Resistance: 100kR; Temperature Coefficient: 100ppm/°C; Voltage Rating (DC): 75V; NCM: 8533.21.20; Case/Package: 0603; Case Code (Imperial): 0603; Case Code (Metric): 1608; ComponentLink1Description: http://www.vishay.com/docs/20035/dcrcwe3.pdf?src-supplier=Digi-Key; ComponentLink1URL: http://www.vishay.com/docs/20035/dcrcwe3.pdf?src-supplier=Digi-Key; ComponentLink2Description: http://www.farnell.com/datasheets/2310790.pdf?src-supplier=Element14; ComponentLink2URL: http://www.farnell.com/datasheets/2310790.pdf?src-supplier=Element14; ComponentLink3Description: https://www.verical.com/server-webapp/html/getDatasheet?partID=93113&src-supplier=Verical; ComponentLink3URL: https://www.verical.com/server-webapp/html/getDatasheet?partID=93113&src-supplier=Verical; ComponentLink4Description: http://www.farnell.com/datasheets/2045673.pdf?src-supplier=Element14; ComponentLink4URL: http://www.farnell.com/datasheets/2045673.pdf?src-supplier=Element14; ComponentLink5Description: http://www.farnell.com/datasheets/2310790.pdf?src-supplier=Avnet; ComponentLink5URL: http://www.farnell.com/datasheets/2310790.pdf?src-supplier=Avnet; ComponentLink6Description: http://www.farnell.com/datasheets/2310790.pdf?src-supplier=Allied+Electronics; ComponentLink6URL: http://www.farnell.com/datasheets/2310790.pdf?src-supplier=Allied+Electronics; ComponentLink7Description: http://www.vishay.com/docs/20035/dcrcwe3.pdf?src-supplier=Avnet; ComponentLink7URL: http://www.vishay.com/docs/20035/dcrcwe3.pdf?src-supplier=Avnet; ComponentLink8Description: http://www.farnell.com/datasheets/2310790.pdf?src-supplier=Mouser; ComponentLink8URL: http://www.farnell.com/datasheets/2310790.pdf?src-supplier=Mouser; ComponentLink9Description: http://uk.rs-online.com/webdocs/0d98/0900766b80d98afc.pdf?src-supplier=RSComponents; ComponentLink9URL: http://uk.rs-online.com/webdocs/0d98/0900766b80d98afc.pdf?src-supplier=RSComponents; ComponentLink10Description: http://www.farnell.com/datasheets/2310790.pdf?src-supplier=Distrelec; ComponentLink10URL: http://www.farnell.com/datasheets/2310790.pdf?src-supplier=Distrelec; ComponentLink11Description: http://www.vishay.com/docs/20008/dcrcw.pdf?src-supplier=Avnet+Europe; ComponentLink11URL: http://www.vishay.com/docs/20008/dcrcw.pdf?src-supplier=Avnet+Europe; Composition: Thick Film; Contact Plating: Tin,Lead; Depth: 0.85mm; Features: Automotive AEC-Q200; Height: 0.45mm; Lead Free: Lead Free; Length: 1.55mm; Max Operating Temperature: 155°C; Military Standard: Not; Min Operating Temperature: -55°C; Number of Pins: 2; Number of Terminations: 2; Package Quantity: 10; Packaging: Tape and Reel; Power Rating: 100mW; Pricing 1: 1=0.1, 10=0.037, 100=0.015, 500=0.006, 1000=0.004, 5000=0.004 (USD); Pricing 2: 1=0.1, 10=0.034, 100=0.0139, 1000=0.00623, 2500=0.0054 (USD); Radiation Hardening: No; REACH SVHC: Unknown; Stock 1: 53; Stock 2: 34451; Supplier 1: Mouser; Supplier 2: Digi-Key; Supplier Part Number 1: 71-CRCW0603-100K-E3; Supplier Part Number 2: 541-100KHCT-ND; Termination: SMD/SMT; Tolerance: 1%; Voltage Rating: 75V; Weight: 7.1E-05oz; Width: 0.033inch
U15 U16 U18 U20 U22 U25 = MAX9934TAUA+: Manufacturer: Maxim; -3db Bandwidth: 1.5kHz; Common Mode Rejection Ratio: 128dB; Input Bias Current: 35uA; Input Offset Voltage (Vos): 10uV; Max Supply Voltage: 3.6V; Min Supply Voltage: 2.5V; Nominal Supply Current: 120uA; Number of Amplifiers: 1; Partnumber: MAX9934TAUA+; Bandwidth: 1.5kHz; Case/Package: UMAX; ComponentLink1Description: https://media.digikey.com/pdf/Data%20Sheets/Maxim%20PDFs/PartNumberBreakdown_ds.pdf?src-supplier=Digi-Key; ComponentLink1URL: https://media.digikey.com/pdf/Data%20Sheets/Maxim%20PDFs/PartNumberBreakdown_ds.pdf?src-supplier=Digi-Key; Manufacturer Part Number: MAX9934TAUA+; Max Operating Temperature: 125°C; Min Operating Temperature: -40°C; Number of Circuits: 1; Number of Pins: 8; Operating Supply Current: 120uA; Package Quantity: 50; Packaging: Rail/Tube; Pricing 1: 1=2.18, 10=1.96, 25=1.85, 50=1.85, 100=1.56, 250=1.56 (USD); Pricing 2: 1=2.35, 10=2.112, 25=1.9964, 100=1.6414, 250=1.55904 (USD); Radiation Hardening: No; REACH SVHC: Unknown; Stock 1: 542; Stock 2: 2797; Supplier 1: Mouser; Supplier 2: Digi-Key; Supplier Part Number 1: 700-MAX9934TAUA; Supplier Part Number 2: MAX9934TAUA+-ND
U17 U19 U21 U24 = TLV341AIDBVR: Manufacturer: Texas Instruments; Bandwidth: 2.2MHz; Common Mode Rejection Ratio: 50dB; Gain Bandwidth Product: 2.3MHz; Input Bias Current: 3nA; Input Offset Voltage (Vos): 1.25mV; Max Supply Voltage: 5.5V; Min Supply Voltage: 1.5V; Nominal Supply Current: 150uA; Number of Channels: 1; Operating Supply Current: 75uA; Output Current: 115mA; Slew Rate: 0.9V/µs; Voltage Gain: 110dB; Partnumber: TLV341AIDBVR; Case/Package: SOT-23-6; ComponentLink1Description: http://www.ti.com/lit/ds/symlink/tlv341.pdf?src-supplier=Digi-Key; ComponentLink1URL: http://www.ti.com/lit/ds/symlink/tlv341.pdf?src-supplier=Digi-Key; ComponentLink2Description: http://focus.ti.com/lit/ds/symlink/tlv341.pdf?src-supplier=Avnet; ComponentLink2URL: http://focus.ti.com/lit/ds/symlink/tlv341.pdf?src-supplier=Avnet; Lead Free: Lead Free; Manufacturer Part Number: TLV341AIDBVR; Max I/O Voltage: 1.25mV; Max Operating Temperature: 125°C; Min Operating Temperature: -40°C; Nominal Gain Bandwidth Product: 2.2MHz; Number of Circuits: 1; Number of Elements: 1; Number of Pins: 6; Output Current per Channel: 115mA; Package Quantity: 1; Packaging: Tape and Reel; Pricing 1: 1=1.1, 10=0.927, 100=0.712, 250=0.629, 500=0.596, 1000=0.464 (USD); Pricing 2: 1=1.09, 10=0.976, 25=0.9268, 100=0.7117, 250=0.62892, 500=0.5958, 1000=0.4634 (USD); Radiation Hardening: No; Stock 1: 2448; Stock 2: 1726; Supplier 1: Mouser; Supplier 2: Digi-Key; Supplier Part Number 1: 595-TLV341AIDBVR; Supplier Part Number 2: 296-17680-1-ND; Unity Gain Bandwidth Product: 2.3MHz